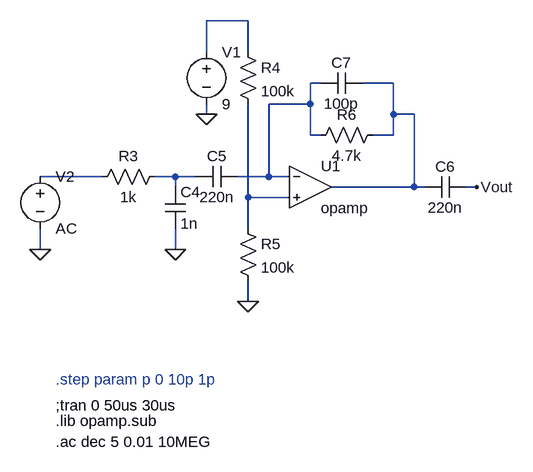
[diagram p0: schematic 2polefilter.asc]
2polefilter.asc, the LTspice schematic file:
Version 4
SHEET 1 1256 756
WIRE 624 -112 560 -112
WIRE 560 -64 560 -112
WIRE 624 -64 624 -112
WIRE 736 -16 720 -16
WIRE 848 -16 800 -16
WIRE 720 16 720 -16
WIRE 720 16 656 16
WIRE 560 32 560 16
WIRE 848 32 848 -16
WIRE 880 32 848 32
WIRE 720 64 720 16
WIRE 736 64 720 64
WIRE 848 64 848 32
WIRE 848 64 816 64
WIRE 400 128 304 128
WIRE 512 128 480 128
WIRE 544 128 512 128
WIRE 656 128 656 16
WIRE 656 128 608 128
WIRE 688 128 656 128
WIRE 512 144 512 128
WIRE 880 144 880 32
WIRE 880 144 752 144
WIRE 896 144 880 144
WIRE 976 144 960 144
WIRE 624 160 624 16
WIRE 688 160 624 160
WIRE 624 208 624 160
WIRE 304 240 304 208
WIRE 512 240 512 208
WIRE 624 320 624 288
FLAG 512 240 0
FLAG 560 32 0
FLAG 624 320 0
FLAG 976 144 Vout
FLAG 304 240 0
SYMBOL res 496 112 R90
WINDOW 0 0 56 VBottom 0
WINDOW 3 32 56 VTop 0
SYMATTR InstName R3
SYMATTR Value 1k
SYMBOL cap 496 144 R0
SYMATTR InstName C4
SYMATTR Value 1n
SYMBOL cap 608 112 R90
WINDOW 0 0 32 VBottom 0
WINDOW 3 32 32 VTop 0
SYMATTR InstName C5
SYMATTR Value 220n
SYMBOL cap 960 128 R90
WINDOW 0 0 32 VBottom 0
WINDOW 3 32 32 VTop 0
SYMATTR InstName C6
SYMATTR Value 220n
SYMBOL cap 800 -32 R90
WINDOW 0 0 32 VBottom 0
WINDOW 3 32 32 VTop 0
SYMATTR InstName C7
SYMATTR Value 100p
SYMBOL Opamps\\opamp 720 80 R0
SYMATTR InstName U1
SYMBOL voltage 560 -80 R0
WINDOW 123 0 0 Left 0
WINDOW 39 0 0 Left 0
SYMATTR InstName V1
SYMATTR Value 9
SYMBOL res 608 -80 R0
SYMATTR InstName R4
SYMATTR Value 100k
SYMBOL res 608 192 R0
SYMATTR InstName R5
SYMATTR Value 100k
SYMBOL res 832 48 R90
WINDOW 0 0 56 VBottom 0
WINDOW 3 32 56 VTop 0
SYMATTR InstName R6
SYMATTR Value 4.7k
SYMBOL voltage 304 112 R0
WINDOW 123 0 0 Left 0
WINDOW 39 0 0 Left 0
SYMATTR InstName V2
SYMATTR Value AC
TEXT 328 480 Left 0 !;tran 0 50us 30us
TEXT 328 440 Left 0 ;.step param p 0 10p 1p
TEXT 328 504 Left 0 !.lib opamp.sub
TEXT 328 536 Left 0 !.ac dec 5 0.01 10MEG

The netlist it stands for:
* 2polefilter.asc
R3 N005 N004 1k
C4 N005 0 1n
C5 N002 N005 220n
C6 Vout N003 220n
C7 N003 N002 100p
XU1 N002 N006 N003 opamp Aol=100K GBW=10Meg  ; pins invin noninvin out
V1 N001 0 9
R4 N001 N006 100k
R5 N006 0 100k
R6 N003 N002 4.7k
V2 N004 0 AC
;tran 0 50us 30us
* .step param p 0 10p 1p
.lib opamp.sub
.ac dec 5 0.01 10MEG
.backanno
.end